# EAGLE design Heater_subassembly_revA (EAGLE 9.5.2)
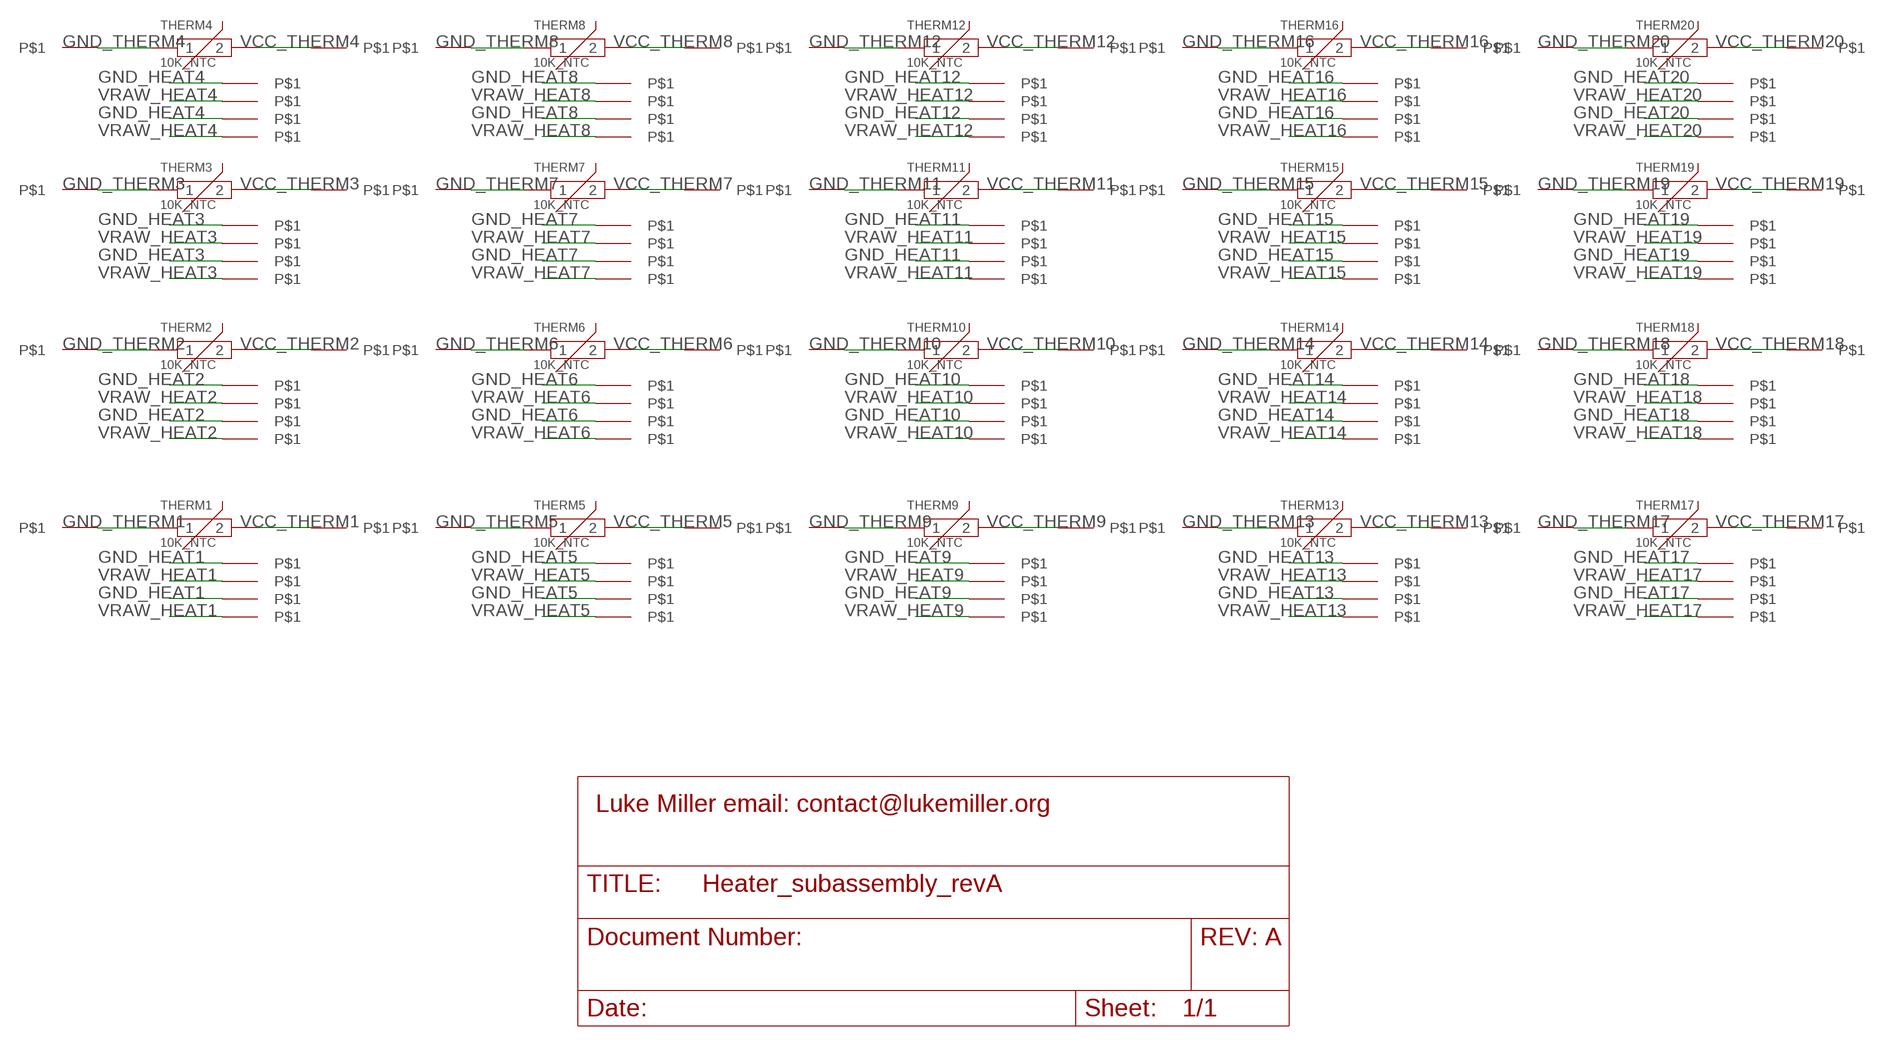
[diagram p0: schematic, sheet 1]

## Parts
GND_HEAT1  PINHD-1X1SMALL  [1X01_SMALL]
GND_HEAT2  PINHD-1X1SMALL  [1X01_SMALL]
GND_HEAT3  PINHD-1X1SMALL  [1X01_SMALL]
GND_HEAT4  PINHD-1X1SMALL  [1X01_SMALL]
GND_HEAT5  PINHD-1X1SMALL  [1X01_SMALL]
GND_HEAT6  PINHD-1X1SMALL  [1X01_SMALL]
GND_HEAT7  PINHD-1X1SMALL  [1X01_SMALL]
GND_HEAT8  PINHD-1X1SMALL  [1X01_SMALL]
GND_HEAT9  PINHD-1X1SMALL  [1X01_SMALL]
GND_HEAT10  PINHD-1X1SMALL  [1X01_SMALL]
GND_HEAT11  PINHD-1X1SMALL  [1X01_SMALL]
GND_HEAT12  PINHD-1X1SMALL  [1X01_SMALL]
GND_HEAT13  PINHD-1X1SMALL  [1X01_SMALL]
GND_HEAT14  PINHD-1X1SMALL  [1X01_SMALL]
GND_HEAT15  PINHD-1X1SMALL  [1X01_SMALL]
GND_HEAT16  PINHD-1X1SMALL  [1X01_SMALL]
GND_HEAT17  PINHD-1X1SMALL  [1X01_SMALL]
GND_HEAT18  PINHD-1X1SMALL  [1X01_SMALL]
GND_HEAT19  PINHD-1X1SMALL  [1X01_SMALL]
GND_HEAT20  PINHD-1X1SMALL  [1X01_SMALL]
GND_NICHROME1  PINHD-1X10.7MM_DRILL  [1X01_SMALL_0.7]
GND_NICHROME2  PINHD-1X10.7MM_DRILL  [1X01_SMALL_0.7]
GND_NICHROME3  PINHD-1X10.7MM_DRILL  [1X01_SMALL_0.7]
GND_NICHROME4  PINHD-1X10.7MM_DRILL  [1X01_SMALL_0.7]
GND_NICHROME5  PINHD-1X10.7MM_DRILL  [1X01_SMALL_0.7]
GND_NICHROME6  PINHD-1X10.7MM_DRILL  [1X01_SMALL_0.7]
GND_NICHROME7  PINHD-1X10.7MM_DRILL  [1X01_SMALL_0.7]
GND_NICHROME8  PINHD-1X10.7MM_DRILL  [1X01_SMALL_0.7]
GND_NICHROME9  PINHD-1X10.7MM_DRILL  [1X01_SMALL_0.7]
GND_NICHROME10  PINHD-1X10.7MM_DRILL  [1X01_SMALL_0.7]
GND_NICHROME11  PINHD-1X10.7MM_DRILL  [1X01_SMALL_0.7]
GND_NICHROME12  PINHD-1X10.7MM_DRILL  [1X01_SMALL_0.7]
GND_NICHROME13  PINHD-1X10.7MM_DRILL  [1X01_SMALL_0.7]
GND_NICHROME14  PINHD-1X10.7MM_DRILL  [1X01_SMALL_0.7]
GND_NICHROME15  PINHD-1X10.7MM_DRILL  [1X01_SMALL_0.7]
GND_NICHROME16  PINHD-1X10.7MM_DRILL  [1X01_SMALL_0.7]
GND_NICHROME17  PINHD-1X10.7MM_DRILL  [1X01_SMALL_0.7]
GND_NICHROME18  PINHD-1X10.7MM_DRILL  [1X01_SMALL_0.7]
GND_NICHROME19  PINHD-1X10.7MM_DRILL  [1X01_SMALL_0.7]
GND_NICHROME20  PINHD-1X10.7MM_DRILL  [1X01_SMALL_0.7]
GND_THERM1  PINHD-1X1SMALL  [1X01_SMALL]
GND_THERM2  PINHD-1X1SMALL  [1X01_SMALL]
GND_THERM3  PINHD-1X1SMALL  [1X01_SMALL]
GND_THERM4  PINHD-1X1SMALL  [1X01_SMALL]
GND_THERM5  PINHD-1X1SMALL  [1X01_SMALL]
GND_THERM6  PINHD-1X1SMALL  [1X01_SMALL]
GND_THERM7  PINHD-1X1SMALL  [1X01_SMALL]
GND_THERM8  PINHD-1X1SMALL  [1X01_SMALL]
GND_THERM9  PINHD-1X1SMALL  [1X01_SMALL]
GND_THERM10  PINHD-1X1SMALL  [1X01_SMALL]
GND_THERM11  PINHD-1X1SMALL  [1X01_SMALL]
GND_THERM12  PINHD-1X1SMALL  [1X01_SMALL]
GND_THERM13  PINHD-1X1SMALL  [1X01_SMALL]
GND_THERM14  PINHD-1X1SMALL  [1X01_SMALL]
GND_THERM16  PINHD-1X1SMALL  [1X01_SMALL]
GND_THERM17  PINHD-1X1SMALL  [1X01_SMALL]
GND_THERM18  PINHD-1X1SMALL  [1X01_SMALL]
GND_THERM19  PINHD-1X1SMALL  [1X01_SMALL]
GND_THERM20  PINHD-1X1SMALL  [1X01_SMALL]
THERM1  10K_NTC  THERMISTOR_NTC_SMD0603  [R0603_THERMISTOR]
THERM2  10K_NTC  THERMISTOR_NTC_SMD0603  [R0603_THERMISTOR]
THERM3  10K_NTC  THERMISTOR_NTC_SMD0603  [R0603_THERMISTOR]
THERM4  10K_NTC  THERMISTOR_NTC_SMD0603  [R0603_THERMISTOR]
THERM5  10K_NTC  THERMISTOR_NTC_SMD0603  [R0603_THERMISTOR]
THERM6  10K_NTC  THERMISTOR_NTC_SMD0603  [R0603_THERMISTOR]
THERM7  10K_NTC  THERMISTOR_NTC_SMD0603  [R0603_THERMISTOR]
THERM8  10K_NTC  THERMISTOR_NTC_SMD0603  [R0603_THERMISTOR]
THERM9  10K_NTC  THERMISTOR_NTC_SMD0603  [R0603_THERMISTOR]
THERM10  10K_NTC  THERMISTOR_NTC_SMD0603  [R0603_THERMISTOR]
THERM11  10K_NTC  THERMISTOR_NTC_SMD0603  [R0603_THERMISTOR]
THERM12  10K_NTC  THERMISTOR_NTC_SMD0603  [R0603_THERMISTOR]
THERM13  10K_NTC  THERMISTOR_NTC_SMD0603  [R0603_THERMISTOR]
THERM14  10K_NTC  THERMISTOR_NTC_SMD0603  [R0603_THERMISTOR]
THERM15  10K_NTC  THERMISTOR_NTC_SMD0603  [R0603_THERMISTOR]
THERM16  10K_NTC  THERMISTOR_NTC_SMD0603  [R0603_THERMISTOR]
THERM17  10K_NTC  THERMISTOR_NTC_SMD0603  [R0603_THERMISTOR]
THERM18  10K_NTC  THERMISTOR_NTC_SMD0603  [R0603_THERMISTOR]
THERM19  10K_NTC  THERMISTOR_NTC_SMD0603  [R0603_THERMISTOR]
THERM20  10K_NTC  THERMISTOR_NTC_SMD0603  [R0603_THERMISTOR]
U$30  PINHD-1X1SMALL  [1X01_SMALL]
VCC_THERM1  PINHD-1X1SMALL  [1X01_SMALL]
VCC_THERM2  PINHD-1X1SMALL  [1X01_SMALL]
VCC_THERM3  PINHD-1X1SMALL  [1X01_SMALL]
VCC_THERM4  PINHD-1X1SMALL  [1X01_SMALL]
VCC_THERM5  PINHD-1X1SMALL  [1X01_SMALL]
VCC_THERM6  PINHD-1X1SMALL  [1X01_SMALL]
VCC_THERM7  PINHD-1X1SMALL  [1X01_SMALL]
VCC_THERM8  PINHD-1X1SMALL  [1X01_SMALL]
VCC_THERM9  PINHD-1X1SMALL  [1X01_SMALL]
VCC_THERM10  PINHD-1X1SMALL  [1X01_SMALL]
VCC_THERM11  PINHD-1X1SMALL  [1X01_SMALL]
VCC_THERM12  PINHD-1X1SMALL  [1X01_SMALL]
VCC_THERM13  PINHD-1X1SMALL  [1X01_SMALL]
VCC_THERM14  PINHD-1X1SMALL  [1X01_SMALL]
VCC_THERM15  PINHD-1X1SMALL  [1X01_SMALL]
VCC_THERM16  PINHD-1X1SMALL  [1X01_SMALL]
VCC_THERM17  PINHD-1X1SMALL  [1X01_SMALL]
VCC_THERM18  PINHD-1X1SMALL  [1X01_SMALL]
VCC_THERM19  PINHD-1X1SMALL  [1X01_SMALL]
VCC_THERM20  PINHD-1X1SMALL  [1X01_SMALL]
VRAW_HEAT1  PINHD-1X1SMALL  [1X01_SMALL]
VRAW_HEAT2  PINHD-1X1SMALL  [1X01_SMALL]
VRAW_HEAT3  PINHD-1X1SMALL  [1X01_SMALL]
VRAW_HEAT4  PINHD-1X1SMALL  [1X01_SMALL]
VRAW_HEAT5  PINHD-1X1SMALL  [1X01_SMALL]
VRAW_HEAT6  PINHD-1X1SMALL  [1X01_SMALL]
VRAW_HEAT7  PINHD-1X1SMALL  [1X01_SMALL]
VRAW_HEAT8  PINHD-1X1SMALL  [1X01_SMALL]
VRAW_HEAT9  PINHD-1X1SMALL  [1X01_SMALL]
VRAW_HEAT10  PINHD-1X1SMALL  [1X01_SMALL]
VRAW_HEAT11  PINHD-1X1SMALL  [1X01_SMALL]
VRAW_HEAT12  PINHD-1X1SMALL  [1X01_SMALL]
VRAW_HEAT13  PINHD-1X1SMALL  [1X01_SMALL]
VRAW_HEAT14  PINHD-1X1SMALL  [1X01_SMALL]
VRAW_HEAT15  PINHD-1X1SMALL  [1X01_SMALL]
VRAW_HEAT16  PINHD-1X1SMALL  [1X01_SMALL]
VRAW_HEAT17  PINHD-1X1SMALL  [1X01_SMALL]
VRAW_HEAT18  PINHD-1X1SMALL  [1X01_SMALL]
VRAW_HEAT19  PINHD-1X1SMALL  [1X01_SMALL]
VRAW_HEAT20  PINHD-1X1SMALL  [1X01_SMALL]
VRAW_NICHROME1  PINHD-1X10.7MM_DRILL  [1X01_SMALL_0.7]
VRAW_NICHROME2  PINHD-1X10.7MM_DRILL  [1X01_SMALL_0.7]
VRAW_NICHROME3  PINHD-1X10.7MM_DRILL  [1X01_SMALL_0.7]
VRAW_NICHROME4  PINHD-1X10.7MM_DRILL  [1X01_SMALL_0.7]
VRAW_NICHROME5  PINHD-1X10.7MM_DRILL  [1X01_SMALL_0.7]
VRAW_NICHROME6  PINHD-1X10.7MM_DRILL  [1X01_SMALL_0.7]
VRAW_NICHROME7  PINHD-1X10.7MM_DRILL  [1X01_SMALL_0.7]
VRAW_NICHROME8  PINHD-1X10.7MM_DRILL  [1X01_SMALL_0.7]
VRAW_NICHROME9  PINHD-1X10.7MM_DRILL  [1X01_SMALL_0.7]
VRAW_NICHROME10  PINHD-1X10.7MM_DRILL  [1X01_SMALL_0.7]
VRAW_NICHROME11  PINHD-1X10.7MM_DRILL  [1X01_SMALL_0.7]
VRAW_NICHROME12  PINHD-1X10.7MM_DRILL  [1X01_SMALL_0.7]
VRAW_NICHROME13  PINHD-1X10.7MM_DRILL  [1X01_SMALL_0.7]
VRAW_NICHROME14  PINHD-1X10.7MM_DRILL  [1X01_SMALL_0.7]
VRAW_NICHROME15  PINHD-1X10.7MM_DRILL  [1X01_SMALL_0.7]
VRAW_NICHROME16  PINHD-1X10.7MM_DRILL  [1X01_SMALL_0.7]
VRAW_NICHROME17  PINHD-1X10.7MM_DRILL  [1X01_SMALL_0.7]
VRAW_NICHROME18  PINHD-1X10.7MM_DRILL  [1X01_SMALL_0.7]
VRAW_NICHROME19  PINHD-1X10.7MM_DRILL  [1X01_SMALL_0.7]
VRAW_NICHROME20  PINHD-1X10.7MM_DRILL  [1X01_SMALL_0.7]

## Nets
GND_HEAT1: GND_HEAT1.1 GND_NICHROME1.P$1
GND_HEAT2: GND_HEAT2.1 GND_NICHROME2.P$1
GND_HEAT3: GND_HEAT3.1 GND_NICHROME3.P$1
GND_HEAT4: GND_HEAT4.1 GND_NICHROME4.P$1
GND_HEAT5: GND_HEAT5.1 GND_NICHROME5.P$1
GND_HEAT6: GND_HEAT6.1 GND_NICHROME6.P$1
GND_HEAT7: GND_HEAT7.1 GND_NICHROME7.P$1
GND_HEAT8: GND_HEAT8.1 GND_NICHROME8.P$1
GND_HEAT9: GND_HEAT9.1 GND_NICHROME9.P$1
GND_HEAT10: GND_HEAT10.1 GND_NICHROME10.P$1
GND_HEAT11: GND_HEAT11.1 GND_NICHROME11.P$1
GND_HEAT12: GND_HEAT12.1 GND_NICHROME12.P$1
GND_HEAT13: GND_HEAT13.1 GND_NICHROME13.P$1
GND_HEAT14: GND_HEAT14.1 GND_NICHROME14.P$1
GND_HEAT15: GND_HEAT15.1 GND_NICHROME15.P$1
GND_HEAT16: GND_HEAT16.1 GND_NICHROME16.P$1
GND_HEAT17: GND_HEAT17.1 GND_NICHROME17.P$1
GND_HEAT18: GND_HEAT18.1 GND_NICHROME18.P$1
GND_HEAT19: GND_HEAT19.1 GND_NICHROME19.P$1
GND_HEAT20: GND_HEAT20.1 GND_NICHROME20.P$1
GND_THERM1: GND_THERM1.1 THERM1.1
GND_THERM2: GND_THERM2.1 THERM2.1
GND_THERM3: GND_THERM3.1 THERM3.1
GND_THERM4: GND_THERM4.1 THERM4.1
GND_THERM5: GND_THERM5.1 THERM5.1
GND_THERM6: GND_THERM6.1 THERM6.1
GND_THERM7: GND_THERM7.1 THERM7.1
GND_THERM8: GND_THERM8.1 THERM8.1
GND_THERM9: GND_THERM9.1 THERM9.1
GND_THERM10: GND_THERM10.1 THERM10.1
GND_THERM11: GND_THERM11.1 THERM11.1
GND_THERM12: GND_THERM12.1 THERM12.1
GND_THERM13: GND_THERM13.1 THERM13.1
GND_THERM14: GND_THERM14.1 THERM14.1
GND_THERM15: THERM15.1 U$30.1
GND_THERM16: GND_THERM16.1 THERM16.1
GND_THERM17: GND_THERM17.1 THERM17.1
GND_THERM18: GND_THERM18.1 THERM18.1
GND_THERM19: GND_THERM19.1 THERM19.1
GND_THERM20: GND_THERM20.1 THERM20.1
VCC_THERM1: THERM1.2 VCC_THERM1.1
VCC_THERM2: THERM2.2 VCC_THERM2.1
VCC_THERM3: THERM3.2 VCC_THERM3.1
VCC_THERM4: THERM4.2 VCC_THERM4.1
VCC_THERM5: THERM5.2 VCC_THERM5.1
VCC_THERM6: THERM6.2 VCC_THERM6.1
VCC_THERM7: THERM7.2 VCC_THERM7.1
VCC_THERM8: THERM8.2 VCC_THERM8.1
VCC_THERM9: THERM9.2 VCC_THERM9.1
VCC_THERM10: THERM10.2 VCC_THERM10.1
VCC_THERM11: THERM11.2 VCC_THERM11.1
VCC_THERM12: THERM12.2 VCC_THERM12.1
VCC_THERM13: THERM13.2 VCC_THERM13.1
VCC_THERM14: THERM14.2 VCC_THERM14.1
VCC_THERM15: THERM15.2 VCC_THERM15.1
VCC_THERM16: THERM16.2 VCC_THERM16.1
VCC_THERM17: THERM17.2 VCC_THERM17.1
VCC_THERM18: THERM18.2 VCC_THERM18.1
VCC_THERM19: THERM19.2 VCC_THERM19.1
VCC_THERM20: THERM20.2 VCC_THERM20.1
VRAW_HEAT1: VRAW_HEAT1.1 VRAW_NICHROME1.P$1
VRAW_HEAT2: VRAW_HEAT2.1 VRAW_NICHROME2.P$1
VRAW_HEAT3: VRAW_HEAT3.1 VRAW_NICHROME3.P$1
VRAW_HEAT4: VRAW_HEAT4.1 VRAW_NICHROME4.P$1
VRAW_HEAT5: VRAW_HEAT5.1 VRAW_NICHROME5.P$1
VRAW_HEAT6: VRAW_HEAT6.1 VRAW_NICHROME6.P$1
VRAW_HEAT7: VRAW_HEAT7.1 VRAW_NICHROME7.P$1
VRAW_HEAT8: VRAW_HEAT8.1 VRAW_NICHROME8.P$1
VRAW_HEAT9: VRAW_HEAT9.1 VRAW_NICHROME9.P$1
VRAW_HEAT10: VRAW_HEAT10.1 VRAW_NICHROME10.P$1
VRAW_HEAT11: VRAW_HEAT11.1 VRAW_NICHROME11.P$1
VRAW_HEAT12: VRAW_HEAT12.1 VRAW_NICHROME12.P$1
VRAW_HEAT13: VRAW_HEAT13.1 VRAW_NICHROME13.P$1
VRAW_HEAT14: VRAW_HEAT14.1 VRAW_NICHROME14.P$1
VRAW_HEAT15: VRAW_HEAT15.1 VRAW_NICHROME15.P$1
VRAW_HEAT16: VRAW_HEAT16.1 VRAW_NICHROME16.P$1
VRAW_HEAT17: VRAW_HEAT17.1 VRAW_NICHROME17.P$1
VRAW_HEAT18: VRAW_HEAT18.1 VRAW_NICHROME18.P$1
VRAW_HEAT19: VRAW_HEAT19.1 VRAW_NICHROME19.P$1
VRAW_HEAT20: VRAW_HEAT20.1 VRAW_NICHROME20.P$1

## Library data of the parts
GND_HEAT1-GND_HEAT20 GND_NICHROME1-GND_NICHROME20 GND_THERM1-GND_THERM14 GND_THERM16-GND_THERM20 U$30 VCC_THERM1-VCC_THERM20 VRAW_HEAT1-VRAW_HEAT20 VRAW_NICHROME1-VRAW_NICHROME20 = miller:PINHD-1X1: Just a single pin header, useful for making test point or stand-alone header hole for normal 0.1" pitch through-hole header pins The SMALL footprint is 0.035" diameter, barely large enough for standard 0.1" pitch header pins. The SMALL_0.7 footprint is 1.056mm diameter, drill hole is 0.7mm, too small for 0.1" pitch header pins
THERM1-THERM20 = miller:THERMISTOR_NTC_SMD: NTC Thermistor

## Board
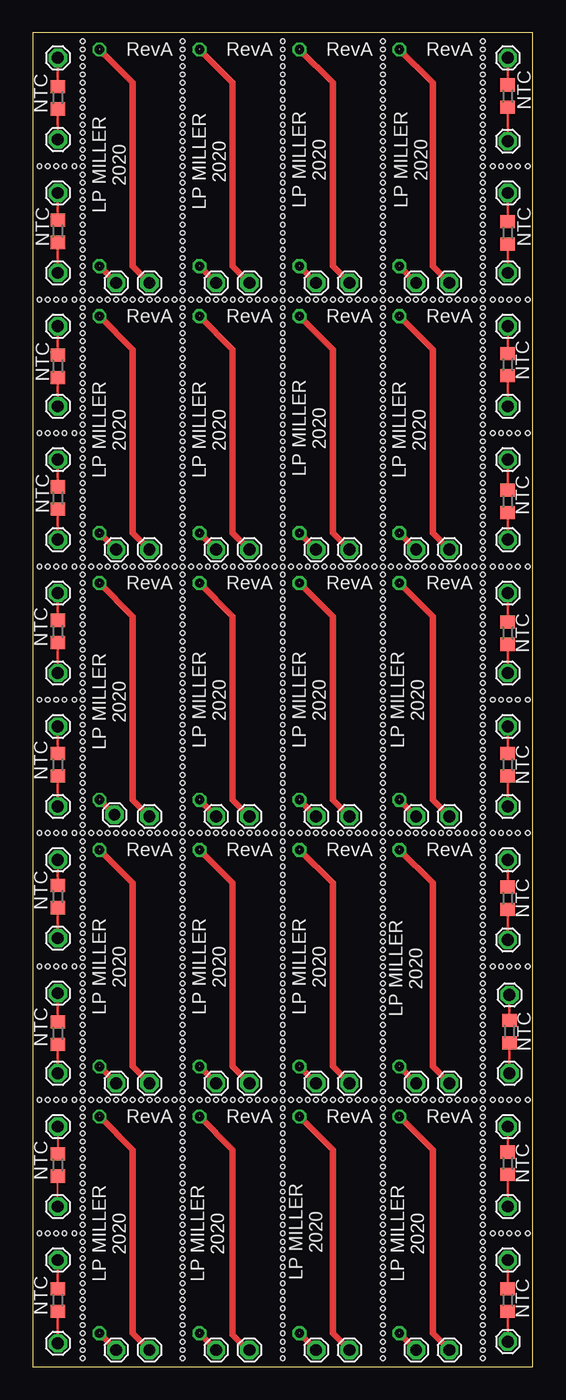
[diagram p1: board, top side]
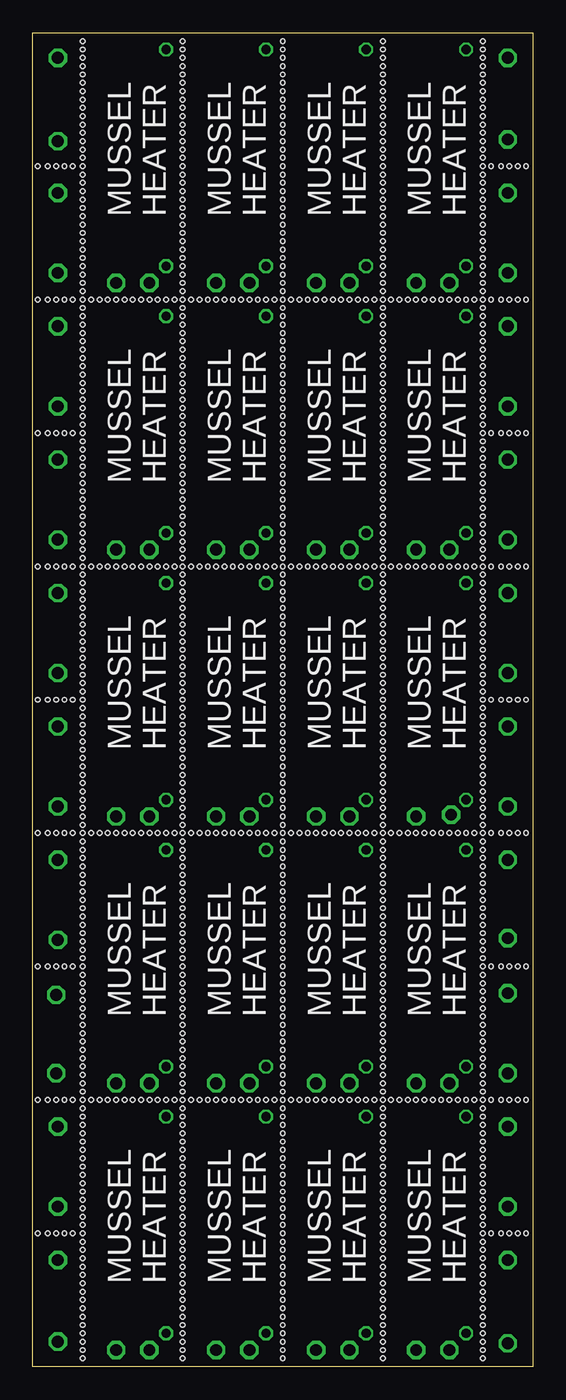
[diagram p2: board, bottom side, seen from below]

Size 38.1 x 101.6 mm. Coordinates in mm from the lower left corner, seen from the top.
Outline: 0,0 38.1,0 38.1,101.6 0,101.6 0,0
Copper layers (1*16): Top 0.035559375mm / dielectric 1.6mm / Bottom 0.035559375mm
Design rules "oshpark-2layer": minimum track width 6mil, minimum drill 10mil, track to track 6mil, track to pad 6mil, pad to pad 6mil, via to via 6mil, smd to smd 6mil, copper to edge 15mil, drill to drill 6mil, minimum pad ring 5mil, minimum via ring 5mil, stop-mask expansion 2.5mil, vias tented up to drill 0mil, thermal gap 10mil
Holes 0.35 mm at 3.81,0.64 3.81,1.27 3.81,1.91 3.81,2.54 3.81,3.17 3.81,3.81 3.81,4.45 3.81,5.08 3.81,5.71 3.81,6.35 3.81,6.99 3.81,7.62 3.81,8.26 3.81,8.89 3.81,9.53 3.81,10.16 3.81,10.79 3.81,11.43 3.81,12.06 3.81,12.7 3.81,13.34 3.81,13.97 3.81,14.61 3.81,15.24 3.81,15.88 3.81,16.51 3.81,17.14 3.81,17.78 3.81,18.41 3.81,19.05 3.81,19.68 3.81,20.32 4.45,20.32 5.08,20.32 5.71,20.32 6.35,20.32 6.99,20.32 7.62,20.32 8.26,20.32 8.89,20.32 9.53,20.32 10.16,20.32 10.79,20.32 11.43,20.32 11.43,0.64 11.43,1.27 11.43,1.91 11.43,2.54 11.43,3.17 11.43,3.81 11.43,4.45 11.43,5.08 11.43,5.71 11.43,6.35 11.43,6.99 11.43,7.62 11.43,8.26 11.43,8.89 11.43,9.53 11.43,10.16 11.43,10.79 11.43,11.43 11.43,12.06 11.43,12.7 11.43,13.34 11.43,13.97 11.43,14.61 11.43,15.24 11.43,15.88 11.43,16.51 11.43,17.14 11.43,17.78 11.43,18.41 11.43,19.05 11.43,19.68 12.06,20.32 12.7,20.32 13.34,20.32 13.97,20.32 14.61,20.32 15.24,20.32 15.88,20.32 16.51,20.32 17.14,20.32 17.78,20.32 18.41,20.32 19.05,20.32 19.05,0.64 19.05,1.27 19.05,1.91 19.05,2.54 19.05,3.17 19.05,3.81 19.05,4.45 19.05,5.08 19.05,5.71 19.05,6.35 19.05,6.99 19.05,7.62 19.05,8.26 19.05,8.89 19.05,9.53 19.05,10.16 19.05,10.79 19.05,11.43 19.05,12.06 19.05,12.7 19.05,13.34 19.05,13.97 19.05,14.61 19.05,15.24 19.05,15.88 19.05,16.51 19.05,17.14 19.05,17.78 19.05,18.41 19.05,19.05 19.05,19.68 3.81,20.95 3.81,21.59 3.81,22.23 3.81,22.86 3.81,23.5 3.81,24.13 3.81,24.77 3.81,25.4 3.81,26.04 3.81,26.67 3.81,27.3 3.81,27.94 3.81,28.57 3.81,29.21 3.81,29.84 3.81,30.48 3.81,31.11 3.81,31.75 3.81,32.38 3.81,33.02 3.81,33.66 3.81,34.29 3.81,34.92 3.81,35.56 3.81,36.2 3.81,36.83 3.81,37.47 3.81,38.1 3.81,38.73 3.81,39.37 3.81,40.01 3.81,40.64 4.45,40.64 5.08,40.64 5.71,40.64 6.35,40.64 6.99,40.64 7.62,40.64 8.26,40.64 8.89,40.64 9.53,40.64 10.16,40.64 10.79,40.64 11.43,40.64 11.43,20.95 11.43,21.59 11.43,22.23 11.43,22.86 11.43,23.5 11.43,24.13 11.43,24.77 11.43,25.4 11.43,26.04 11.43,26.67 11.43,27.3 11.43,27.94 11.43,28.57 11.43,29.21 11.43,29.84 11.43,30.48 11.43,31.11 11.43,31.75 11.43,32.38 11.43,33.02 11.43,33.66 11.43,34.29 11.43,34.92 11.43,35.56 11.43,36.2 11.43,36.83 11.43,37.47 11.43,38.1 11.43,38.73 11.43,39.37 11.43,40.01 12.06,40.64 12.7,40.64 13.34,40.64 13.97,40.64 14.61,40.64 15.24,40.64 15.88,40.64 16.51,40.64 17.14,40.64 17.78,40.64 18.41,40.64 19.05,40.64 19.05,20.95 19.05,21.59 19.05,22.23 19.05,22.86 19.05,23.5 19.05,24.13 19.05,24.77 19.05,25.4 19.05,26.04 19.05,26.67 19.05,27.3 19.05,27.94 19.05,28.57 19.05,29.21 19.05,29.84 19.05,30.48 19.05,31.11 19.05,31.75 19.05,32.38 19.05,33.02 19.05,33.66 19.05,34.29 19.05,34.92 19.05,35.56 19.05,36.2 19.05,36.83 19.05,37.47 19.05,38.1 19.05,38.73 19.05,39.37 19.05,40.01 3.81,41.27 3.81,41.91 3.81,42.55 3.81,43.18 3.81,43.81 3.81,44.45 3.81,45.09 3.81,45.72 3.81,46.35 3.81,46.99 3.81,47.62 3.81,48.26 3.81,48.9 3.81,49.53 3.81,50.16 3.81,50.8 3.81,51.44 3.81,52.07 3.81,52.7 3.81,53.34 3.81,53.98 3.81,54.61 3.81,55.24 3.81,55.88 3.81,56.52 3.81,57.15 3.81,57.78 3.81,58.42 3.81,59.05 3.81,59.69 3.81,60.33 3.81,60.96 4.45,60.96 5.08,60.96 5.71,60.96 6.35,60.96 6.99,60.96 7.62,60.96 8.26,60.96 8.89,60.96 9.53,60.96 10.16,60.96 10.79,60.96 11.43,60.96 11.43,41.27 11.43,41.91 11.43,42.55 11.43,43.18 11.43,43.81 11.43,44.45 11.43,45.09 11.43,45.72 11.43,46.35 11.43,46.99 11.43,47.62 11.43,48.26 11.43,48.9 11.43,49.53 11.43,50.16 11.43,50.8 11.43,51.44 11.43,52.07 11.43,52.7 11.43,53.34 11.43,53.98 11.43,54.61 11.43,55.24 11.43,55.88 11.43,56.52 11.43,57.15 11.43,57.78 11.43,58.42 11.43,59.05 11.43,59.69 11.43,60.33 12.06,60.96 12.7,60.96 13.34,60.96 13.97,60.96 14.61,60.96 15.24,60.96 15.88,60.96 16.51,60.96 17.14,60.96 17.78,60.96 18.41,60.96 19.05,60.96 19.05,41.27 19.05,41.91 19.05,42.55 19.05,43.18 19.05,43.81 19.05,44.45 19.05,45.09 19.05,45.72 19.05,46.35 19.05,46.99 19.05,47.62 19.05,48.26 19.05,48.9 19.05,49.53 19.05,50.16 19.05,50.8 19.05,51.44 19.05,52.07 19.05,52.7 19.05,53.34 19.05,53.98 19.05,54.61 19.05,55.24 19.05,55.88 19.05,56.52 19.05,57.15 19.05,57.78 19.05,58.42 19.05,59.05 19.05,59.69 19.05,60.33 3.81,61.59 3.81,62.23 3.81,62.87 3.81,63.5 3.81,64.14 3.81,64.77 3.81,65.41 3.81,66.04 3.81,66.67 3.81,67.31 3.81,67.94 3.81,68.58 3.81,69.22 3.81,69.85 3.81,70.48 3.81,71.12 3.81,71.75 3.81,72.39 3.81,73.03 3.81,73.66 3.81,74.3 3.81,74.93 3.81,75.56 3.81,76.2 3.81,76.83 3.81,77.47 3.81,78.11 3.81,78.74 3.81,79.38 3.81,80.01 3.81,80.64 3.81,81.28 4.45,81.28 5.08,81.28 5.71,81.28 6.35,81.28 6.99,81.28 7.62,81.28 8.26,81.28 8.89,81.28 9.53,81.28 10.16,81.28 10.79,81.28 11.43,81.28 11.43,61.59 11.43,62.23 11.43,62.87 11.43,63.5 11.43,64.14 11.43,64.77 11.43,65.41 11.43,66.04 11.43,66.67 11.43,67.31 11.43,67.94 11.43,68.58 11.43,69.22 11.43,69.85 11.43,70.48 11.43,71.12 11.43,71.75 11.43,72.39 11.43,73.03 11.43,73.66 11.43,74.3 11.43,74.93 11.43,75.56 11.43,76.2 11.43,76.83 11.43,77.47 11.43,78.11 11.43,78.74 11.43,79.38 11.43,80.01 11.43,80.64 12.06,81.28 12.7,81.28 13.34,81.28 13.97,81.28 14.61,81.28 15.24,81.28 15.88,81.28 16.51,81.28 17.14,81.28 17.78,81.28 18.41,81.28 19.05,81.28 19.05,61.59 19.05,62.23 19.05,62.87 19.05,63.5 19.05,64.14 19.05,64.77 19.05,65.41 19.05,66.04 19.05,66.67 19.05,67.31 19.05,67.94 19.05,68.58 19.05,69.22 19.05,69.85 19.05,70.48 19.05,71.12 19.05,71.75 19.05,72.39 19.05,73.03 19.05,73.66 19.05,74.3 19.05,74.93 19.05,75.56 19.05,76.2 19.05,76.83 19.05,77.47 19.05,78.11 19.05,78.74 19.05,79.38 19.05,80.01 19.05,80.64 19.68,20.32 20.32,20.32 20.95,20.32 21.59,20.32 22.23,20.32 22.86,20.32 23.5,20.32 24.13,20.32 24.77,20.32 25.4,20.32 26.04,20.32 26.67,20.32 26.67,0.64 26.67,1.27 26.67,1.91 26.67,2.54 26.67,3.17 26.67,3.81 26.67,4.45 26.67,5.08 26.67,5.71 26.67,6.35 26.67,6.99 26.67,7.62 26.67,8.26 26.67,8.89 26.67,9.53 26.67,10.16 26.67,10.79 26.67,11.43 26.67,12.06 26.67,12.7 26.67,13.34 26.67,13.97 26.67,14.61 26.67,15.24 26.67,15.88 26.67,16.51 26.67,17.14 26.67,17.78 26.67,18.41 26.67,19.05 26.67,19.68 27.3,20.32 27.94,20.32 28.57,20.32 29.21,20.32 29.84,20.32 30.48,20.32 31.11,20.32 31.75,20.32 32.38,20.32 33.02,20.32 33.66,20.32 34.29,20.32 34.29,0.64 34.29,1.27 34.29,1.91 34.29,2.54 34.29,3.17 34.29,3.81 34.29,4.45 34.29,5.08 34.29,5.71 34.29,6.35 34.29,6.99 34.29,7.62 34.29,8.26 34.29,8.89 34.29,9.53 34.29,10.16 34.29,10.79 34.29,11.43 34.29,12.06 34.29,12.7 34.29,13.34 34.29,13.97 34.29,14.61 34.29,15.24 34.29,15.88 34.29,16.51 34.29,17.14 34.29,17.78 34.29,18.41 34.29,19.05 34.29,19.68 19.68,40.64 20.32,40.64 20.95,40.64 21.59,40.64 22.23,40.64 22.86,40.64 23.5,40.64 24.13,40.64 24.77,40.64 25.4,40.64 26.04,40.64 26.67,40.64 26.67,20.95 26.67,21.59 26.67,22.23 26.67,22.86 26.67,23.5 26.67,24.13 26.67,24.77 26.67,25.4 26.67,26.04 26.67,26.67 26.67,27.3 26.67,27.94 26.67,28.57 26.67,29.21 26.67,29.84 26.67,30.48 26.67,31.11 26.67,31.75 26.67,32.38 26.67,33.02 26.67,33.66 26.67,34.29 26.67,34.92 26.67,35.56 26.67,36.2 26.67,36.83 26.67,37.47 26.67,38.1 26.67,38.73 26.67,39.37 26.67,40.01 27.3,40.64 27.94,40.64 28.57,40.64 29.21,40.64 29.84,40.64 30.48,40.64 31.11,40.64 31.75,40.64 32.38,40.64 33.02,40.64 33.66,40.64 34.29,40.64 34.29,20.95 34.29,21.59 34.29,22.23 34.29,22.86 34.29,23.5 34.29,24.13 34.29,24.77 34.29,25.4 34.29,26.04 34.29,26.67 34.29,27.3 34.29,27.94 34.29,28.57 34.29,29.21 34.29,29.84 34.29,30.48 34.29,31.11 34.29,31.75 34.29,32.38 34.29,33.02 34.29,33.66 34.29,34.29 34.29,34.92 34.29,35.56 34.29,36.2 34.29,36.83 34.29,37.47 34.29,38.1 34.29,38.73 34.29,39.37 34.29,40.01 19.68,60.96 20.32,60.96 20.95,60.96 21.59,60.96 22.23,60.96 22.86,60.96 23.5,60.96 24.13,60.96 24.77,60.96 25.4,60.96 26.04,60.96 26.67,60.96 26.67,41.27 26.67,41.91 26.67,42.55 26.67,43.18 26.67,43.81 26.67,44.45 26.67,45.09 26.67,45.72 26.67,46.35 26.67,46.99 26.67,47.62 26.67,48.26 26.67,48.9 26.67,49.53 26.67,50.16 26.67,50.8 26.67,51.44 26.67,52.07 26.67,52.7 26.67,53.34 26.67,53.98 26.67,54.61 26.67,55.24 26.67,55.88 26.67,56.52 26.67,57.15 26.67,57.78 26.67,58.42 26.67,59.05 26.67,59.69 26.67,60.33 27.3,60.96 27.94,60.96 28.57,60.96 29.21,60.96 29.84,60.96 30.48,60.96 31.11,60.96 31.75,60.96 32.38,60.96 33.02,60.96 33.66,60.96 34.29,60.96 34.29,41.27 34.29,41.91 34.29,42.55 34.29,43.18 34.29,43.81 34.29,44.45 34.29,45.09 34.29,45.72 34.29,46.35 34.29,46.99 34.29,47.62 34.29,48.26 34.29,48.9 34.29,49.53 34.29,50.16 34.29,50.8 34.29,51.44 34.29,52.07 34.29,52.7 34.29,53.34 34.29,53.98 34.29,54.61 34.29,55.24 34.29,55.88 34.29,56.52 34.29,57.15 34.29,57.78 34.29,58.42 34.29,59.05 34.29,59.69 34.29,60.33 19.68,81.28 20.32,81.28 20.95,81.28 21.59,81.28 22.23,81.28 22.86,81.28 23.5,81.28 24.13,81.28 24.77,81.28 25.4,81.28 26.04,81.28 26.67,81.28 26.67,61.59 26.67,62.23 26.67,62.87 26.67,63.5 26.67,64.14 26.67,64.77 26.67,65.41 26.67,66.04 26.67,66.67 26.67,67.31 26.67,67.94 26.67,68.58 26.67,69.22 26.67,69.85 26.67,70.48 26.67,71.12 26.67,71.75 26.67,72.39 26.67,73.03 26.67,73.66 26.67,74.3 26.67,74.93 26.67,75.56 26.67,76.2 26.67,76.83 26.67,77.47 26.67,78.11 26.67,78.74 26.67,79.38 26.67,80.01 26.67,80.64 27.3,81.28 27.94,81.28 28.57,81.28 29.21,81.28 29.84,81.28 30.48,81.28 31.11,81.28 31.75,81.28 32.38,81.28 33.02,81.28 33.66,81.28 34.29,81.28 34.29,61.59 34.29,62.23 34.29,62.87 34.29,63.5 34.29,64.14 34.29,64.77 34.29,65.41 34.29,66.04 34.29,66.67 34.29,67.31 34.29,67.94 34.29,68.58 34.29,69.22 34.29,69.85 34.29,70.48 34.29,71.12 34.29,71.75 34.29,72.39 34.29,73.03 34.29,73.66 34.29,74.3 34.29,74.93 34.29,75.56 34.29,76.2 34.29,76.83 34.29,77.47 34.29,78.11 34.29,78.74 34.29,79.38 34.29,80.01 34.29,80.64 3.81,81.92 3.81,82.55 3.81,83.19 3.81,83.82 3.81,84.45 3.81,85.09 3.81,85.72 3.81,86.36 3.81,87 3.81,87.63 3.81,88.27 3.81,88.9 3.81,89.53 3.81,90.17 3.81,90.81 3.81,91.44 3.81,92.08 3.81,92.71 3.81,93.34 3.81,93.98 3.81,94.61 3.81,95.25 3.81,95.89 3.81,96.52 3.81,97.16 3.81,97.79 3.81,98.42 3.81,99.06 3.81,99.69 3.81,100.33 3.81,100.97 11.43,81.92 11.43,82.55 11.43,83.19 11.43,83.82 11.43,84.45 11.43,85.09 11.43,85.72 11.43,86.36 11.43,87 11.43,87.63 11.43,88.27 11.43,88.9 11.43,89.53 11.43,90.17 11.43,90.81 11.43,91.44 11.43,92.08 11.43,92.71 11.43,93.34 11.43,93.98 11.43,94.61 11.43,95.25 11.43,95.89 11.43,96.52 11.43,97.16 11.43,97.79 11.43,98.42 11.43,99.06 11.43,99.69 11.43,100.33 11.43,100.97 19.05,81.92 19.05,82.55 19.05,83.19 19.05,83.82 19.05,84.45 19.05,85.09 19.05,85.72 19.05,86.36 19.05,87 19.05,87.63 19.05,88.27 19.05,88.9 19.05,89.53 19.05,90.17 19.05,90.81 19.05,91.44 19.05,92.08 19.05,92.71 19.05,93.34 19.05,93.98 19.05,94.61 19.05,95.25 19.05,95.89 19.05,96.52 19.05,97.16 19.05,97.79 19.05,98.42 19.05,99.06 19.05,99.69 19.05,100.33 19.05,100.97 26.67,81.92 26.67,82.55 26.67,83.19 26.67,83.82 26.67,84.45 26.67,85.09 26.67,85.72 26.67,86.36 26.67,87 26.67,87.63 26.67,88.27 26.67,88.9 26.67,89.53 26.67,90.17 26.67,90.81 26.67,91.44 26.67,92.08 26.67,92.71 26.67,93.34 26.67,93.98 26.67,94.61 26.67,95.25 26.67,95.89 26.67,96.52 26.67,97.16 26.67,97.79 26.67,98.42 26.67,99.06 26.67,99.69 26.67,100.33 26.67,100.97 34.29,81.92 34.29,82.55 34.29,83.19 34.29,83.82 34.29,84.45 34.29,85.09 34.29,85.72 34.29,86.36 34.29,87 34.29,87.63 34.29,88.27 34.29,88.9 34.29,89.53 34.29,90.17 34.29,90.81 34.29,91.44 34.29,92.08 34.29,92.71 34.29,93.34 34.29,93.98 34.29,94.61 34.29,95.25 34.29,95.89 34.29,96.52 34.29,97.16 34.29,97.79 34.29,98.42 34.29,99.06 34.29,99.69 34.29,100.33 34.29,100.97 0.51,10.16 1.14,10.16 1.78,10.16 2.41,10.16 3.17,10.16 0.51,20.32 1.14,20.32 1.78,20.32 2.41,20.32 3.17,20.32 0.51,30.48 1.14,30.48 1.78,30.48 2.41,30.48 3.17,30.48 0.51,40.64 1.14,40.64 1.78,40.64 2.41,40.64 3.17,40.64 0.51,50.8 1.14,50.8 1.78,50.8 2.41,50.8 3.17,50.8 0.51,60.96 1.14,60.96 1.78,60.96 2.41,60.96 3.17,60.96 0.51,71.12 1.14,71.12 1.78,71.12 2.41,71.12 3.17,71.12 0.51,81.28 1.14,81.28 1.78,81.28 2.41,81.28 3.17,81.28 0.51,91.44 1.14,91.44 1.78,91.44 2.41,91.44 3.17,91.44 35.05,91.44 35.69,91.44 36.32,91.44 36.96,91.44 37.72,91.44 35.05,81.28 35.69,81.28 36.32,81.28 36.96,81.28 37.72,81.28 35.05,71.12 35.69,71.12 36.32,71.12 36.96,71.12 37.72,71.12 35.05,60.96 35.69,60.96 36.32,60.96 36.96,60.96 37.72,60.96 35.05,50.8 35.69,50.8 36.32,50.8 36.96,50.8 37.72,50.8 35.05,40.64 35.69,40.64 36.32,40.64 36.96,40.64 37.72,40.64 35.05,30.48 35.69,30.48 36.32,30.48 36.96,30.48 37.72,30.48 35.05,20.32 35.69,20.32 36.32,20.32 36.96,20.32 37.72,20.32 35.05,10.16 35.69,10.16 36.32,10.16 36.96,10.16 37.72,10.16

### Footprints (pad centres in the part's own frame; a part is rotated, then mirrored left to right if it is on the bottom)
1X01_SMALL = drill 0.9 pad 1.397 octagon: 1 0,0
1X01_SMALL_0.7 = drill 0.7 pad 1.057 octagon: P$1 0,0
R0603_THERMISTOR = smd 1 x 1.1: 1 -0.85,0; 2 0.85,0

### Placement (x,y rotation side)
GND_HEAT1  8.89,1.27 0 top
GND_HEAT2  16.51,1.27 0 top
GND_HEAT3  8.89,21.59 0 top
GND_HEAT4  6.22,42.04 0 top
GND_HEAT5  6.35,62.23 0 top
GND_HEAT6  13.97,21.59 0 top
GND_HEAT7  13.97,41.91 0 top
GND_HEAT8  13.97,62.23 0 top
GND_HEAT9  21.59,1.27 0 top
GND_HEAT10  21.59,21.59 0 top
GND_HEAT11  21.59,41.91 0 top
GND_HEAT12  21.59,62.23 0 top
GND_HEAT13  29.21,1.27 0 top
GND_HEAT14  29.21,21.59 0 top
GND_HEAT15  29.21,41.91 0 top
GND_HEAT16  29.21,62.23 0 top
GND_HEAT17  13.97,82.55 0 top
GND_HEAT18  6.35,82.55 0 top
GND_HEAT19  21.59,82.55 0 top
GND_HEAT20  29.21,82.55 0 top
GND_NICHROME1  5.08,19.05 0 top
GND_NICHROME2  12.7,19.05 0 top
GND_NICHROME3  5.08,39.37 0 top
GND_NICHROME4  5.08,43.18 0 top
GND_NICHROME5  5.08,63.5 0 top
GND_NICHROME6  12.7,22.86 0 top
GND_NICHROME7  12.7,43.18 0 top
GND_NICHROME8  12.7,63.5 0 top
GND_NICHROME9  20.32,2.54 0 top
GND_NICHROME10  20.32,22.86 0 top
GND_NICHROME11  20.32,43.18 0 top
GND_NICHROME12  20.32,63.5 0 top
GND_NICHROME13  27.94,2.54 0 top
GND_NICHROME14  27.94,22.86 0 top
GND_NICHROME15  27.94,43.18 0 top
GND_NICHROME16  27.94,63.5 0 top
GND_NICHROME17  12.7,83.82 0 top
GND_NICHROME18  5.08,83.82 0 top
GND_NICHROME19  20.32,83.82 0 top
GND_NICHROME20  27.94,83.82 0 top
GND_THERM1  1.91,1.78 0 top
GND_THERM2  1.91,12.19 0 top
GND_THERM3  1.91,22.35 0 top
GND_THERM4  1.91,32.64 0 top
GND_THERM5  1.91,42.67 0 top
GND_THERM6  1.91,52.83 0 top
GND_THERM7  1.91,62.99 0 top
GND_THERM8  1.91,73.15 0 top
GND_THERM9  36.2,1.91 0 top
GND_THERM10  36.2,12.19 0 top
GND_THERM11  36.32,22.35 0 top
GND_THERM12  36.2,32.51 0 top
GND_THERM13  36.2,42.67 0 top
GND_THERM14  36.2,52.83 0 top
GND_THERM16  36.2,73.15 0 top
GND_THERM17  1.91,83.31 0 top
GND_THERM18  1.91,93.47 0 top
GND_THERM19  36.2,83.31 0 top
GND_THERM20  36.2,93.34 0 top
THERM1  1.91,5.08 90 top
THERM2  1.91,15.37 90 top
THERM3  1.91,25.4 90 top
THERM4  1.91,35.81 90 top
THERM5  1.91,45.85 90 top
THERM6  1.91,56.01 90 top
THERM7  1.91,66.17 90 top
THERM8  1.91,76.2 90 top
THERM9  36.2,5.08 90 top
THERM10  36.2,15.49 90 top
THERM11  36.32,25.53 90 top
THERM12  36.2,35.69 90 top
THERM13  36.2,45.85 90 top
THERM14  36.2,55.88 90 top
THERM15  36.2,65.91 90 top
THERM16  36.2,76.33 90 top
THERM17  1.91,86.49 90 top
THERM18  1.91,96.65 90 top
THERM19  36.2,86.36 90 top
THERM20  36.2,96.77 90 top
U$30  36.2,62.99 0 top
VCC_THERM1  1.91,8.13 0 top
VCC_THERM2  1.91,18.29 0 top
VCC_THERM3  1.91,28.45 0 top
VCC_THERM4  1.91,38.61 0 top
VCC_THERM5  1.91,48.77 0 top
VCC_THERM6  1.91,58.93 0 top
VCC_THERM7  1.91,69.09 0 top
VCC_THERM8  1.91,79.25 0 top
VCC_THERM9  36.2,8.13 0 top
VCC_THERM10  36.2,18.29 0 top
VCC_THERM11  36.32,28.32 0 top
VCC_THERM12  36.2,38.61 0 top
VCC_THERM13  36.2,48.77 0 top
VCC_THERM14  36.2,58.93 0 top
VCC_THERM15  36.2,69.09 0 top
VCC_THERM16  36.2,79.25 0 top
VCC_THERM17  1.91,89.41 0 top
VCC_THERM18  1.91,99.69 0 top
VCC_THERM19  36.2,89.41 0 top
VCC_THERM20  36.2,99.69 0 top
VRAW_HEAT1  6.35,1.27 0 top
VRAW_HEAT2  13.97,1.27 0 top
VRAW_HEAT3  6.35,21.59 0 top
VRAW_HEAT4  8.89,41.91 0 top
VRAW_HEAT5  8.89,62.23 0 top
VRAW_HEAT6  16.51,21.59 0 top
VRAW_HEAT7  16.51,41.91 0 top
VRAW_HEAT8  16.51,62.23 0 top
VRAW_HEAT9  24.13,1.27 0 top
VRAW_HEAT10  24.13,21.59 0 top
VRAW_HEAT11  24.13,41.91 0 top
VRAW_HEAT12  24.13,62.23 0 top
VRAW_HEAT13  31.75,1.27 0 top
VRAW_HEAT14  31.75,21.59 0 top
VRAW_HEAT15  31.75,41.91 0 top
VRAW_HEAT16  31.75,62.23 0 top
VRAW_HEAT17  16.51,82.55 0 top
VRAW_HEAT18  8.89,82.55 0 top
VRAW_HEAT19  24.13,82.55 0 top
VRAW_HEAT20  31.75,82.55 0 top
VRAW_NICHROME1  5.08,2.54 0 top
VRAW_NICHROME2  12.7,2.54 0 top
VRAW_NICHROME3  5.08,22.86 0 top
VRAW_NICHROME4  5.08,59.69 0 top
VRAW_NICHROME5  5.08,80.01 0 top
VRAW_NICHROME6  12.7,39.37 0 top
VRAW_NICHROME7  12.7,59.69 0 top
VRAW_NICHROME8  12.7,80.01 0 top
VRAW_NICHROME9  20.32,19.05 0 top
VRAW_NICHROME10  20.32,39.37 0 top
VRAW_NICHROME11  20.32,59.69 0 top
VRAW_NICHROME12  20.32,80.01 0 top
VRAW_NICHROME13  27.94,19.05 0 top
VRAW_NICHROME14  27.94,39.37 0 top
VRAW_NICHROME15  27.94,59.69 0 top
VRAW_NICHROME16  27.94,80.01 0 top
VRAW_NICHROME17  12.7,100.33 0 top
VRAW_NICHROME18  5.08,100.33 0 top
VRAW_NICHROME19  20.32,100.33 0 top
VRAW_NICHROME20  27.94,100.33 0 top

### Tracks (layer width: path | path; a pad name or v marks a point on that pad's centre or on a via)
GND_HEAT1
  Top 0.508: GND_HEAT1.1 7.62,2.54 7.62,16.51 GND_NICHROME1.P$1
GND_HEAT2
  Top 0.508: GND_HEAT2.1 16.38,1.27 15.24,2.41 15.24,16.51 GND_NICHROME2.P$1
GND_HEAT3
  Top 0.508: GND_NICHROME3.P$1 7.62,36.83 7.62,22.86 GND_HEAT3.1
GND_HEAT4
  Top 0.508: GND_HEAT4.1 GND_NICHROME4.P$1
GND_HEAT5
  Top 0.508: GND_HEAT5.1 GND_NICHROME5.P$1
GND_HEAT6
  Top 0.508: GND_HEAT6.1 GND_NICHROME6.P$1
GND_HEAT7
  Top 0.508: GND_HEAT7.1 GND_NICHROME7.P$1
GND_HEAT8
  Top 0.508: GND_HEAT8.1 GND_NICHROME8.P$1
GND_HEAT9
  Top 0.508: GND_HEAT9.1 GND_NICHROME9.P$1
GND_HEAT10
  Top 0.508: GND_HEAT10.1 GND_NICHROME10.P$1
GND_HEAT11
  Top 0.508: GND_HEAT11.1 GND_NICHROME11.P$1
GND_HEAT12
  Top 0.508: GND_HEAT12.1 GND_NICHROME12.P$1
GND_HEAT13
  Top 0.508: GND_HEAT13.1 GND_NICHROME13.P$1
GND_HEAT14
  Top 0.508: GND_HEAT14.1 GND_NICHROME14.P$1
GND_HEAT15
  Top 0.508: GND_HEAT15.1 GND_NICHROME15.P$1
GND_HEAT16
  Top 0.508: GND_HEAT16.1 GND_NICHROME16.P$1
GND_HEAT17
  Top 0.508: GND_HEAT17.1 GND_NICHROME17.P$1
GND_HEAT18
  Top 0.508: GND_HEAT18.1 GND_NICHROME18.P$1
GND_HEAT19
  Top 0.508: GND_HEAT19.1 GND_NICHROME19.P$1
GND_HEAT20
  Top 0.508: GND_HEAT20.1 GND_NICHROME20.P$1
GND_THERM1
  Top 0.2: GND_THERM1.1 THERM1.1
GND_THERM2
  Top 0.152: GND_THERM2.1 THERM2.1
GND_THERM3
  Top 0.2: GND_THERM3.1 THERM3.1
GND_THERM4
  Top 0.2: GND_THERM4.1 THERM4.1
GND_THERM5
  Top 0.2: GND_THERM5.1 THERM5.1
GND_THERM6
  Top 0.2: GND_THERM6.1 THERM6.1
GND_THERM7
  Top 0.2: GND_THERM7.1 THERM7.1
GND_THERM8
  Top 0.2: GND_THERM8.1 THERM8.1
GND_THERM9
  Top 0.2: GND_THERM9.1 THERM9.1
GND_THERM10
  Top 0.2: GND_THERM10.1 THERM10.1
GND_THERM11
  Top 0.2: GND_THERM11.1 THERM11.1
GND_THERM12
  Top 0.2: GND_THERM12.1 THERM12.1
GND_THERM13
  Top 0.2: GND_THERM13.1 THERM13.1
GND_THERM14
  Top 0.2: GND_THERM14.1 THERM14.1
GND_THERM15
  Top 0.2: U$30.1 THERM15.1
GND_THERM16
  Top 0.2: GND_THERM16.1 THERM16.1
GND_THERM17
  Top 0.2: GND_THERM17.1 THERM17.1
GND_THERM18
  Top 0.2: GND_THERM18.1 THERM18.1
GND_THERM19
  Top 0.2: GND_THERM19.1 THERM19.1
GND_THERM20
  Top 0.2: GND_THERM20.1 THERM20.1
VCC_THERM1
  Top 0.2: VCC_THERM1.1 THERM1.2
VCC_THERM2
  Top 0.152: VCC_THERM2.1 THERM2.2
VCC_THERM3
  Top 0.2: VCC_THERM3.1 THERM3.2
VCC_THERM4
  Top 0.2: VCC_THERM4.1 THERM4.2
VCC_THERM5
  Top 0.2: VCC_THERM5.1 THERM5.2
VCC_THERM6
  Top 0.2: VCC_THERM6.1 THERM6.2
VCC_THERM7
  Top 0.2: VCC_THERM7.1 THERM7.2
VCC_THERM8
  Top 0.2: VCC_THERM8.1 THERM8.2
VCC_THERM9
  Top 0.2: VCC_THERM9.1 THERM9.2
VCC_THERM10
  Top 0.2: VCC_THERM10.1 THERM10.2
VCC_THERM11
  Top 0.2: VCC_THERM11.1 THERM11.2
VCC_THERM12
  Top 0.2: VCC_THERM12.1 THERM12.2
VCC_THERM13
  Top 0.2: VCC_THERM13.1 THERM13.2
VCC_THERM14
  Top 0.2: VCC_THERM14.1 THERM14.2
VCC_THERM15
  Top 0.2: VCC_THERM15.1 THERM15.2
VCC_THERM16
  Top 0.2: VCC_THERM16.1 THERM16.2
VCC_THERM17
  Top 0.2: VCC_THERM17.1 THERM17.2
VCC_THERM18
  Top 0.2: VCC_THERM18.1 THERM18.2
VCC_THERM19
  Top 0.2: VCC_THERM19.1 THERM19.2
VCC_THERM20
  Top 0.2: VCC_THERM20.1 THERM20.2
VRAW_HEAT1
  Top 0.508: VRAW_HEAT1.1 VRAW_NICHROME1.P$1
VRAW_HEAT2
  Top 0.508: VRAW_HEAT2.1 VRAW_NICHROME2.P$1
VRAW_HEAT3
  Top 0.508: VRAW_NICHROME3.P$1 VRAW_HEAT3.1
VRAW_HEAT4
  Top 0.508: VRAW_NICHROME4.P$1 7.62,57.15 7.62,43.18 VRAW_HEAT4.1
VRAW_HEAT5
  Top 0.508: VRAW_NICHROME5.P$1 7.62,77.47 7.62,63.5 VRAW_HEAT5.1
VRAW_HEAT6
  Top 0.508: VRAW_NICHROME6.P$1 15.24,36.83 15.24,22.86 VRAW_HEAT6.1
VRAW_HEAT7
  Top 0.508: VRAW_NICHROME7.P$1 15.24,57.15 15.24,43.18 VRAW_HEAT7.1
VRAW_HEAT8
  Top 0.508: VRAW_NICHROME8.P$1 15.24,77.47 15.24,63.5 VRAW_HEAT8.1
VRAW_HEAT9
  Top 0.508: VRAW_NICHROME9.P$1 22.86,16.51 22.86,2.54 VRAW_HEAT9.1
VRAW_HEAT10
  Top 0.508: VRAW_NICHROME10.P$1 22.86,36.83 22.86,22.86 VRAW_HEAT10.1
VRAW_HEAT11
  Top 0.508: VRAW_NICHROME11.P$1 22.86,57.15 22.86,43.18 VRAW_HEAT11.1
VRAW_HEAT12
  Top 0.508: VRAW_NICHROME12.P$1 22.86,77.47 22.86,63.5 VRAW_HEAT12.1
VRAW_HEAT13
  Top 0.508: VRAW_NICHROME13.P$1 30.48,16.51 30.48,2.54 VRAW_HEAT13.1
VRAW_HEAT14
  Top 0.508: VRAW_NICHROME14.P$1 30.48,36.83 30.48,22.86 VRAW_HEAT14.1
VRAW_HEAT15
  Top 0.508: VRAW_NICHROME15.P$1 30.48,57.15 30.48,43.18 VRAW_HEAT15.1
VRAW_HEAT16
  Top 0.508: VRAW_NICHROME16.P$1 30.48,77.47 30.48,63.5 VRAW_HEAT16.1
VRAW_HEAT17
  Top 0.508: VRAW_NICHROME17.P$1 15.24,97.79 15.24,83.82 VRAW_HEAT17.1
VRAW_HEAT18
  Top 0.508: VRAW_NICHROME18.P$1 7.62,97.79 7.62,83.82 VRAW_HEAT18.1
VRAW_HEAT19
  Top 0.508: VRAW_NICHROME19.P$1 22.86,97.79 22.86,83.82 VRAW_HEAT19.1
VRAW_HEAT20
  Top 0.508: VRAW_NICHROME20.P$1 30.48,97.79 30.48,83.82 VRAW_HEAT20.1

### Text on the board
tPlace: RevA | RevA | RevA | RevA | NTC | NTC | LP MILLER / 2020 | LP MILLER / 2020 | LP MILLER / 2020 | LP MILLER / 2020 | NTC | NTC | RevA | RevA | RevA | RevA | NTC | NTC | LP MILLER / 2020 | LP MILLER / 2020 | LP MILLER / 2020 | LP MILLER / 2020 | NTC | NTC | RevA | RevA | RevA | RevA | NTC | NTC | LP MILLER / 2020 | LP MILLER / 2020 | LP MILLER / 2020 | LP MILLER / 2020 | NTC | NTC | RevA | RevA | RevA | RevA | NTC | NTC | LP MILLER / 2020 | LP MILLER / 2020 | LP MILLER / 2020 | LP MILLER / 2020 | NTC | NTC | RevA | RevA | RevA | RevA | NTC | NTC | LP MILLER / 2020 | LP MILLER / 2020 | LP MILLER / 2020 | LP MILLER / 2020 | NTC | NTC
bPlace: MUSSEL / HEATER | MUSSEL / HEATER | MUSSEL / HEATER | MUSSEL / HEATER | MUSSEL / HEATER | MUSSEL / HEATER | MUSSEL / HEATER | MUSSEL / HEATER | MUSSEL / HEATER | MUSSEL / HEATER | MUSSEL / HEATER | MUSSEL / HEATER | MUSSEL / HEATER | MUSSEL / HEATER | MUSSEL / HEATER | MUSSEL / HEATER | MUSSEL / HEATER | MUSSEL / HEATER | MUSSEL / HEATER | MUSSEL / HEATER